# EasyEDA Pro project smart water meter.eprj

# Schematic Schematic1
Board Name: Board1; Create Date: 2025-05-09; Page Name: P1; Project Name: smart water meter; Schematic Name: Schematic1; Update Date: 2025-05-09; Company: EasyEDA.com; Page Size: A4; Version: V1.0
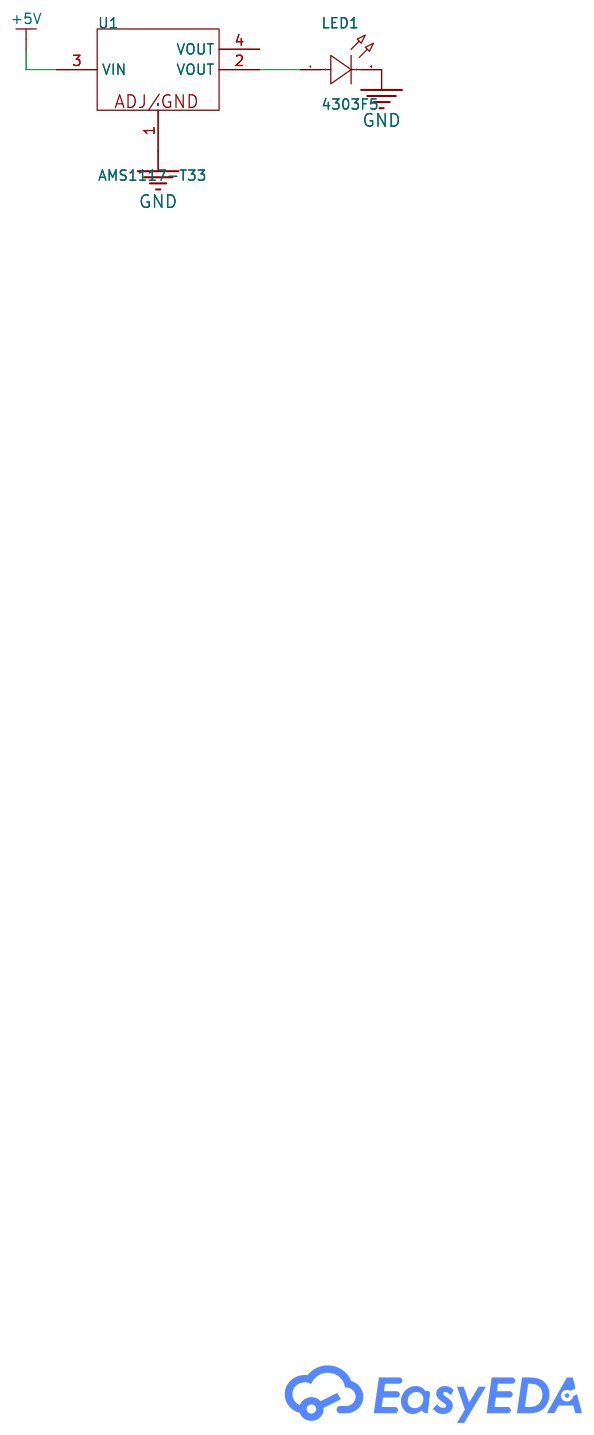
[diagram p0: schematic sheet]

## Parts
LED1  4303F5  [LED-TH_BD3.3-P2.50-RD]
U1  AMS1117-T33  [SOT-223-3_L6.5-W3.4-P2.30-LS7.0-BR]

## Library data of the parts
LED1 = 4303F5: Supplier Part: C3000873; Manufacturer: VCC; Supplier Footprint: 插件,D=3mm; JLCPCB Part Class: Extended Part; Datasheet: https://atta.szlcsc.com/upload/public/pdf/source/20220425/F250163E9CF62A2E564F156C26CEA872.pdf; Supplier: LCSC; Lamp Holder Type: 3mm round bulb
U1 = AMS1117-T33: LCSC Part Name: 停产 AMS1117-T33; Supplier Part: C400139; Manufacturer: UNI-SEMIC(宇力半导体); Supplier Footprint: SOT-223-3; JLCPCB Part Class: Extended Part; Datasheet: https://atta.szlcsc.com/upload/public/pdf/source/20230613/5A88077BE49E09DAF2F35CC0687D8AD7.pdf; Supplier: LCSC; Output Type: Fixed; Voltage - Supply: 12V; Output Voltage: 3.3V; Output Current: 1A; Features: 热关断(TSD)；Overcurrent Protection(OCP); Operating Temperature: -20℃~+105℃; Output Configuration: Positive electrode; Number of Outputs: 1

## Nets
+5V: U1.3(VIN)
GND: LED1.2(K) U1.1(ADJ/GND)
Net-(LED1-1): LED1.1(A) U1.2(VOUT)

Not connected (* = marked no-connect by the designer): U1 4(VOUT)
